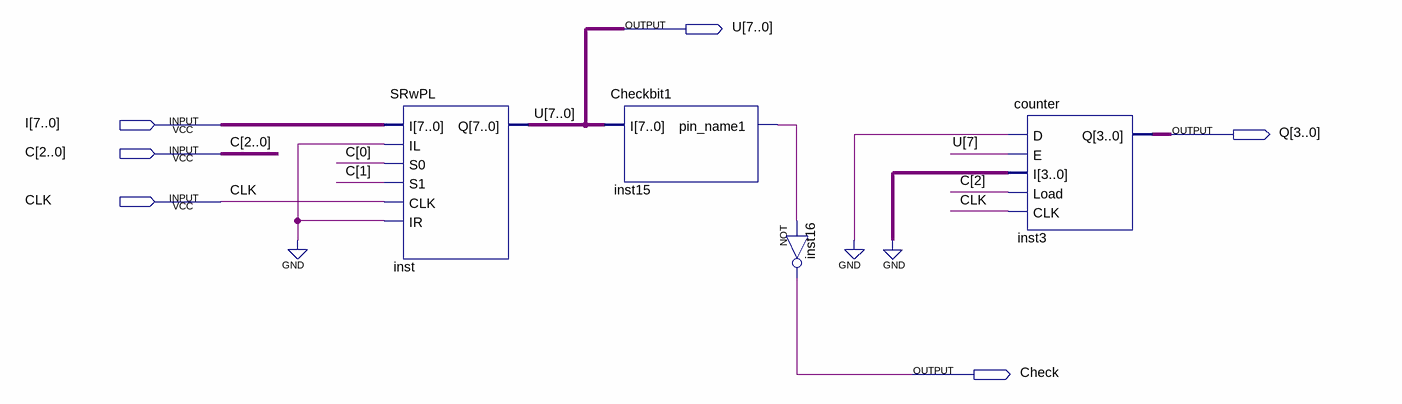
[diagram p0: schematic sheet]
// Quartus schematic Datapath.bdf as structural Verilog: 4 symbols, 6 pins
module Datapath (
  input  [7:0] I,
  input  [2:0] C,
  input  CLK,
  output [7:0] U,
  output [3:0] Q,
  output Check
);

  wire inst15_pin_name1;

  SRwPL inst (.I(I), .IL(1'b0), .S0(C[0]), .S1(C[1]), .CLK(CLK), .IR(1'b0), .Q(U));
  Checkbit1 inst15 (.I(U), .pin_name1(inst15_pin_name1));
  not inst16 (Check, inst15_pin_name1);
  counter inst3 (.D(1'b0), .E(U[7]), .I(4'b0000), .Load(C[2]), .CLK(CLK), .Q(Q));
endmodule
